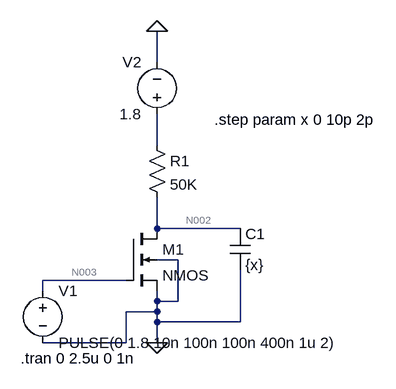
[diagram p0: schematic resistive load inverter.asc]
resistive load inverter.asc, the LTspice schematic file:
Version 4
SHEET 1 880 680
WIRE 176 -128 176 -176
WIRE 176 0 176 -48
WIRE 176 128 176 80
WIRE 304 128 176 128
WIRE 208 176 176 176
WIRE 128 208 0 208
WIRE 0 224 0 208
WIRE 176 240 176 224
WIRE 208 240 208 176
WIRE 208 240 176 240
WIRE 176 256 176 240
WIRE 176 256 128 256
WIRE 176 272 176 256
WIRE 304 272 304 192
WIRE 304 272 176 272
WIRE 128 304 128 256
WIRE 128 304 0 304
WIRE 176 304 176 272
FLAG 176 -176 0
FLAG 176 304 0
SYMBOL nmos4 128 128 R0
SYMATTR InstName M1
SYMATTR Value2 l=180n w=2u
SYMBOL res 160 -16 R0
SYMATTR InstName R1
SYMATTR Value 50K
SYMBOL voltage 176 -32 R180
WINDOW 0 24 96 Left 2
WINDOW 3 24 16 Left 2
WINDOW 123 0 0 Left 0
WINDOW 39 0 0 Left 0
SYMATTR InstName V2
SYMATTR Value 1.8
SYMBOL cap 288 128 R0
SYMATTR InstName C1
SYMATTR Value {x}
SYMBOL voltage 0 208 R0
WINDOW 123 0 0 Left 0
WINDOW 39 0 0 Left 0
SYMATTR InstName V1
SYMATTR Value PULSE(0 1.8 10n 100n 100n 400n 1u 2)
TEXT 264 -40 Left 2 !.step param x 0 10p 2p
TEXT -34 328 Left 2 !.tran 0 2.5u 0 1n

The netlist it stands for:
* resistive load inverter.asc
M1 N002 N003 0 0 NMOS l=180n w=2u
R1 N001 N002 50K
V2 N001 0 1.8
C1 N002 0 {x}
V1 N003 0 PULSE(0 1.8 10n 100n 100n 400n 1u 2)
.model NMOS NMOS
.model PMOS PMOS
.lib standard.mos
.step param x 0 10p 2p
.tran 0 2.5u 0 1n
.backanno
.end

* Results of the author's LTspice run, read from the files saved beside the schematic
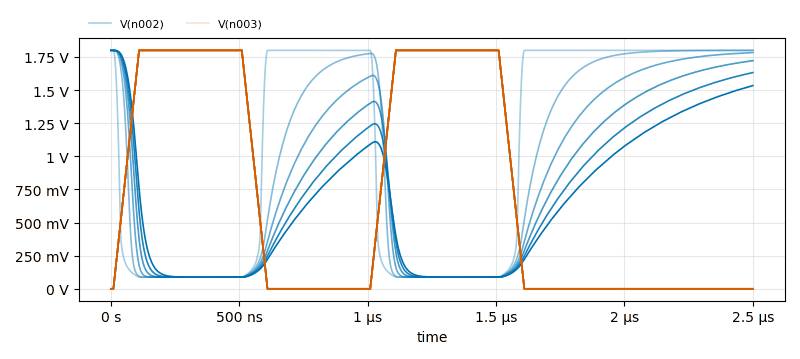
[diagram p1: Transient Analysis of resistive load inverter.asc, plotted from the saved traces]
* Transient Analysis, 6 runs:
*   V(n002) [x=0]: min 87.75 mV, max 1.8 V, average 1.043 V, rms 1.333 V, last 1.8 V
*   V(n002) [x=2e-012]: min 87.75 mV, max 1.8 V, average 958.3 mV, rms 1.228 V, last 1.8 V
*   V(n002) [x=4e-012]: min 87.75 mV, max 1.8 V, average 856.5 mV, rms 1.103 V, last 1.783 V
*   V(n002) [x=6e-012]: min 87.75 mV, max 1.8 V, average 769.7 mV, rms 993.7 mV, last 1.722 V
*   V(n002) [x=8e-012]: min 87.75 mV, max 1.8 V, average 700.5 mV, rms 904.9 mV, last 1.632 V
*   V(n002) [x=1e-011]: min 87.75 mV, max 1.8 V, average 645.8 mV, rms 834 mV, last 1.534 V
*   V(n003) [x=0]: min 0 V, max 1.8 V, average 719.7 mV, rms 1.099 V, last 0 V
*   V(n003) [x=2e-012]: min 0 V, max 1.8 V, average 720 mV, rms 1.1 V, last 0 V
*   V(n003) [x=4e-012]: min 0 V, max 1.8 V, average 720 mV, rms 1.1 V, last 0 V
*   V(n003) [x=6e-012]: min 0 V, max 1.8 V, average 720 mV, rms 1.1 V, last 0 V
*   V(n003) [x=8e-012]: min 0 V, max 1.8 V, average 720 mV, rms 1.1 V, last 0 V
*   V(n003) [x=1e-011]: min 0 V, max 1.8 V, average 720 mV, rms 1.1 V, last 0 V